# EAGLE design ReceptorTori (EAGLE 9.6.2)
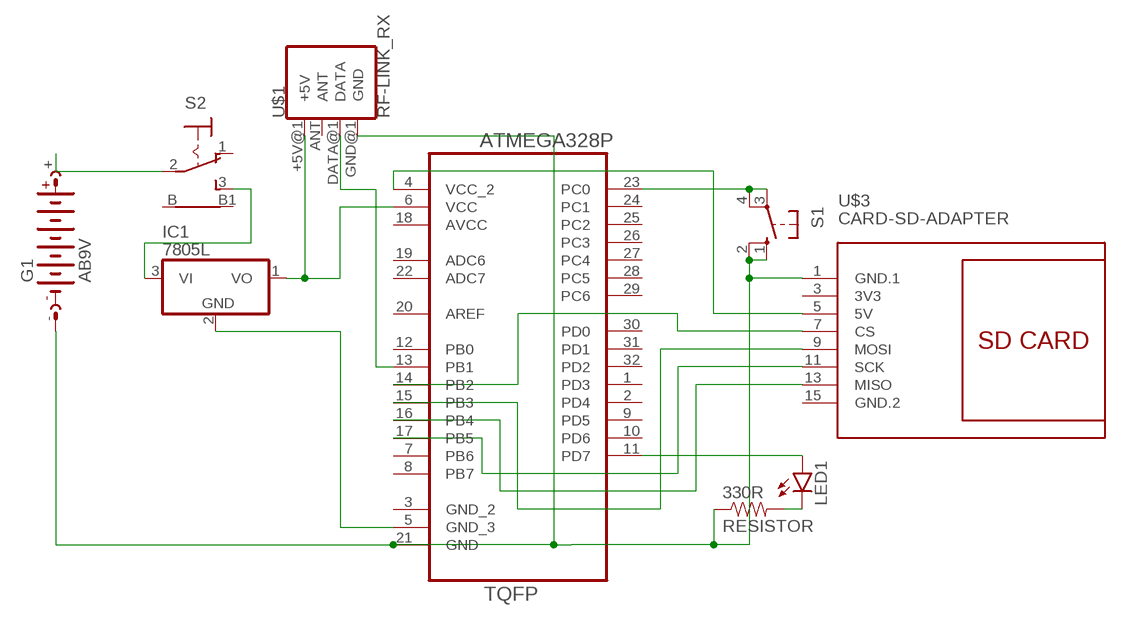
[diagram p0: schematic, sheet 1]

## Parts
330R  RESISTOR  [0603RES]
G1  AB9V  [AB9V]
IC1  7805L  [TO92]
LED1  LED5MM  [LED5MM]
S1  10-XX  [B3F-10XX]
S2  9070-1W  [9070-1W]
U1  ATMEGA328P-AU  [QFP80P900X900X120-32N]
U$1  RF-LINK_RX  [RF-LINK_RX]
U$3  CARD-SD-ADAPTER  [CARD-SD-ADAPTER]

## Nets
N$1: G1.+ S2.2(P)
N$2: IC1.1(VO) U1.6(VCC) U$1.+5V@1(+5V)
N$3: 330R.1 G1.- S1.1(S) S1.2(S1) U1.21(GND) U$1.GND@1(GND) U$3.1(GND.1)
N$4: U1.15(PB3) U$3.9(MOSI)
N$5: U1.17(PB5) U$3.11(SCK)
N$6: U1.16(PB4) U$3.13(MISO)
N$7: U1.14(PB2) U$3.7(CS)
N$8: U1.4(VCC_2) U$3.5(5V)
N$9: U1.13(PB1) U$1.DATA@1(DATA)
N$10: IC1.2(GND) U1.5(GND_3)
N$11: IC1.3(VI) S2.3(S)
N$12: 330R.2 LED1.K(C)
N$13: LED1.A U1.11(PD7)
N$14: S1.3(P) S1.4(P1) U1.23(PC0)
Unconnected: S2.1(O) S2.B S2.B1 U1.1(PD3) U1.2(PD4) U1.3(GND_2) U1.7(PB6) U1.8(PB7) U1.9(PD5) U1.10(PD6) U1.12(PB0) U1.19(ADC6) U1.20(AREF) U1.22(ADC7) U1.24(PC1) U1.25(PC2) U1.26(PC3) U1.27(PC4) U1.28(PC5) U1.29(PC6) U1.30(PD0) U1.31(PD1) U1.32(PD2) U$1.ANT

## Power pins joined to a net without a drawn wire
3V3: U$3.3(3V3)
AVCC: U1.18(AVCC)
GND.2: U$3.15(GND.2)

## Library data of the parts
330R = Ava:RESISTOR
G1 = battery:AB9V: 9-V BATTERY CLIP
IC1 = linear:78*: Positive VOLTAGE REGULATOR Source: http://cache.national.com/ds/LM/LM78L05.pdf http://www.fairchildsemi.com/ds/LM/LM7805.pdf
LED1 = led:LED: LED OSRAM: - CHIPLED LG R971, LG N971, LY N971, LG Q971, LY Q971, LO R971, LY R971 LH N974, LH R974 LS Q976, LO Q976, LY Q976 LO Q996 - Hyper CHIPLED LW Q18S LB Q993, LB Q99A, LB R99A - SideLED LS A670, LO A670, LY A670, LG A670, LP A670 LB A673, LV A673, LT A673, LW A673 LH A674 LY A675 LS A676, LA A676, LO A676, LY A676, LW A676 LS A679, LY A679, LG A679 - Hyper Micro SIDELED® LS Y876, LA Y876, LO Y876, LY Y876 LT Y87S - SmartLED LW L88C, LW L88S LB L89C, LB L89S, LG L890 LS L89K, LO L89K, LY L89K LS L896, LA L896, LO L896, LY L896 - TOPLED LS T670, LO T670, LY T670, LG T670, LP T670 LSG T670, LSP T670, LSY T670, LOP T670, LYG T670 LG T671, LOG T671, LSG T671 LB T673, LV T673, LT T673, LW T673 LH T674 LS T676, LA T676, LO T676, LY T676, LB T676, LH T676, LSB T676, LW T676 LB T67C, LV T67C, LT T67C, LS T67K, LO T67K, LY T67K, LW E67C LS E67B, LA E67B, LO E67B, LY E67B, LB E67C, LV E67C, LT E67C LW T67C LS T679, LY T679, LG T679 LS T770, LO T770, LY T770, LG T770, LP T770 LB T773, LV T773, LT T773, LW T773 LH T774 LS E675, LA E675, LY E675, LS T675 LS T776, LA T776, LO T776, LY T776, LB T776 LHGB T686 LT T68C, LB T68C - Hyper Mini TOPLED® LB M676 - Mini TOPLED Santana® LG M470 LS M47K, LO M47K, LY M47K Source: http://www.osram.convergy.de LUXEON: - LUMILED® LXK2-PW12-R00, LXK2-PW12-S00, LXK2-PW14-U00, LXK2-PW14-V00 LXK2-PM12-R00, LXK2-PM12-S00, LXK2-PM14-U00 LXK2-PE12-Q00, LXK2-PE12-R00, LXK2-PE12-S00, LXK2-PE14-T00, LXK2-PE14-U00 LXK2-PB12-K00, LXK2-PB12-L00, LXK2-PB12-M00, LXK2-PB14-N00, LXK2-PB14-P00, LXK2-PB14-Q00 LXK2-PR12-L00, LXK2-PR12-M00, LXK2-PR14-Q00, LXK2-PR14-R00 LXK2-PD12-Q00, LXK2-PD12-R00, LXK2-PD12-S00 LXK2-PH12-R00, LXK2-PH12-S00 LXK2-PL12-P00, LXK2-PL12-Q00, LXK2-PL12-R00 Source: www.luxeon.com KINGBRIGHT: KA-3528ASYC Source: www.kingbright.com
S1 = switch-omron:10-XX: OMRON SWITCH; MPN: B3F-1000; OC_FARNELL: 176432; OC_NEWARK: 36M3542
S2 = switch:9070-1W: TOGGLE SWITCH Marquardt
U1 = Ava:ATMEGA328P-AU; DESCRIPTION: 8-bit Microcontroller with In-System Programmable Flash; MPN: ATMEGA328P-AU; OC_FARNELL: 1715486; OC_NEWARK: 14R4631; PACKAGE: TQFP-32; SUPPLIER: Atmel
U$1 = SparkFun-RF:RF-LINK_RX: RF Link Receiver (434 MHz, 315 MHz) These wireless receivers work with equivalent transmitters. They can easily fit into a breadboard and work well with microcontrollers to create a very simple wireless data link. Since these are only receivers, they will only work communicating data one-way, you would need two pairs (of different frequencies) to act as a transmitter/receiver pair.. SparkFun Products RF Link Receiver - 4800bps (434 MHz) <https://www.sparkfun.com/products/10532>(WRL-10532); SF_ID: WRL-10533
U$3 = diy-modules:CARD-SD-ADAPTER: Full Size SD Card Adapter Module with onboard 3.3V regulator

## Board
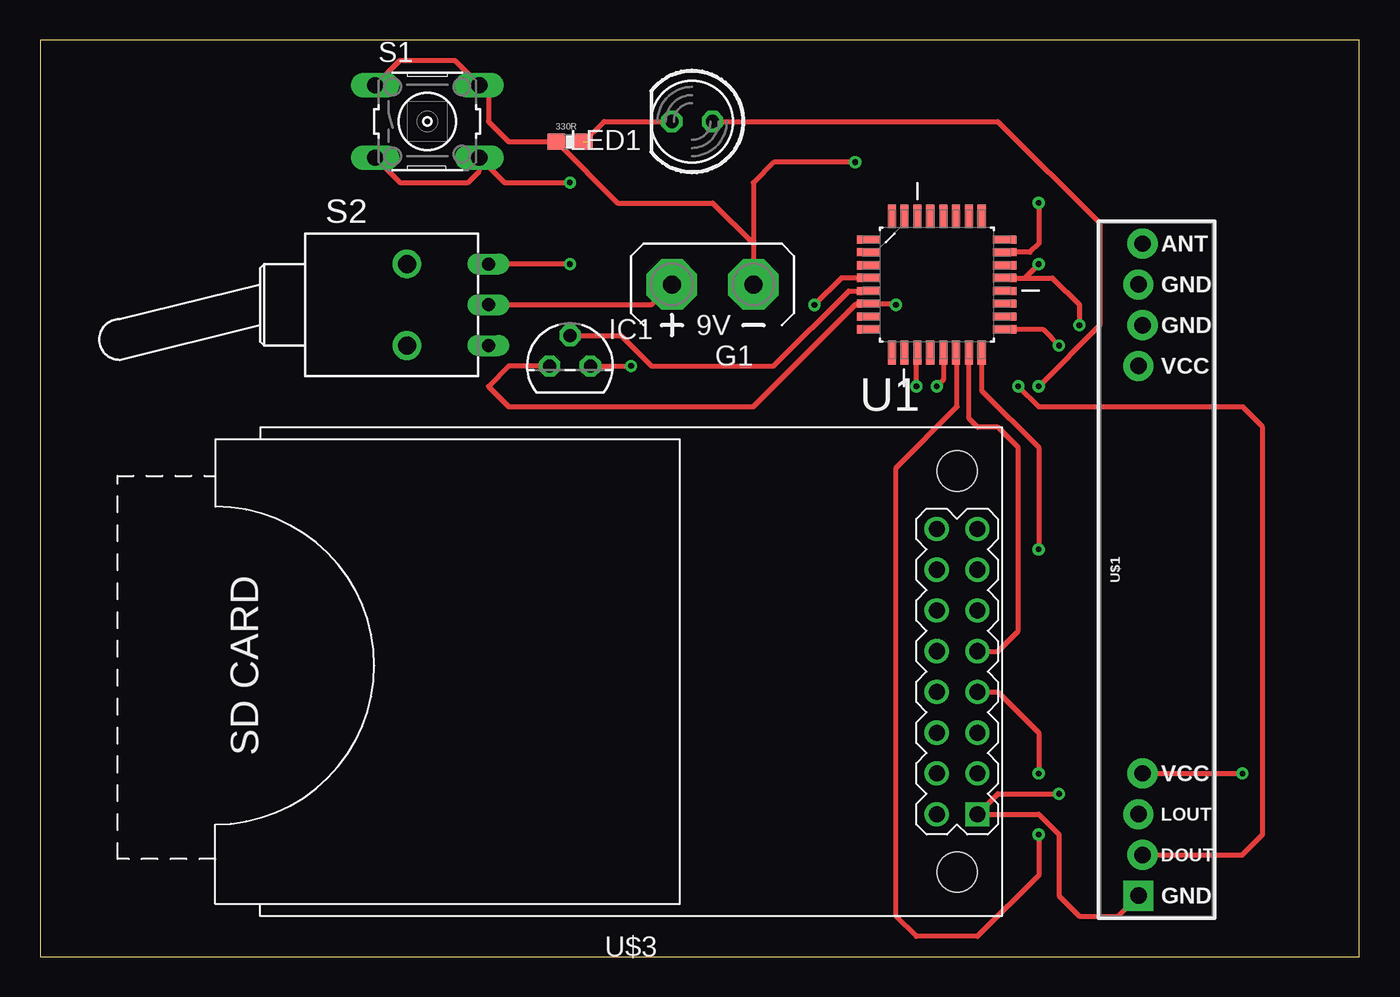
[diagram p1: board, top side]
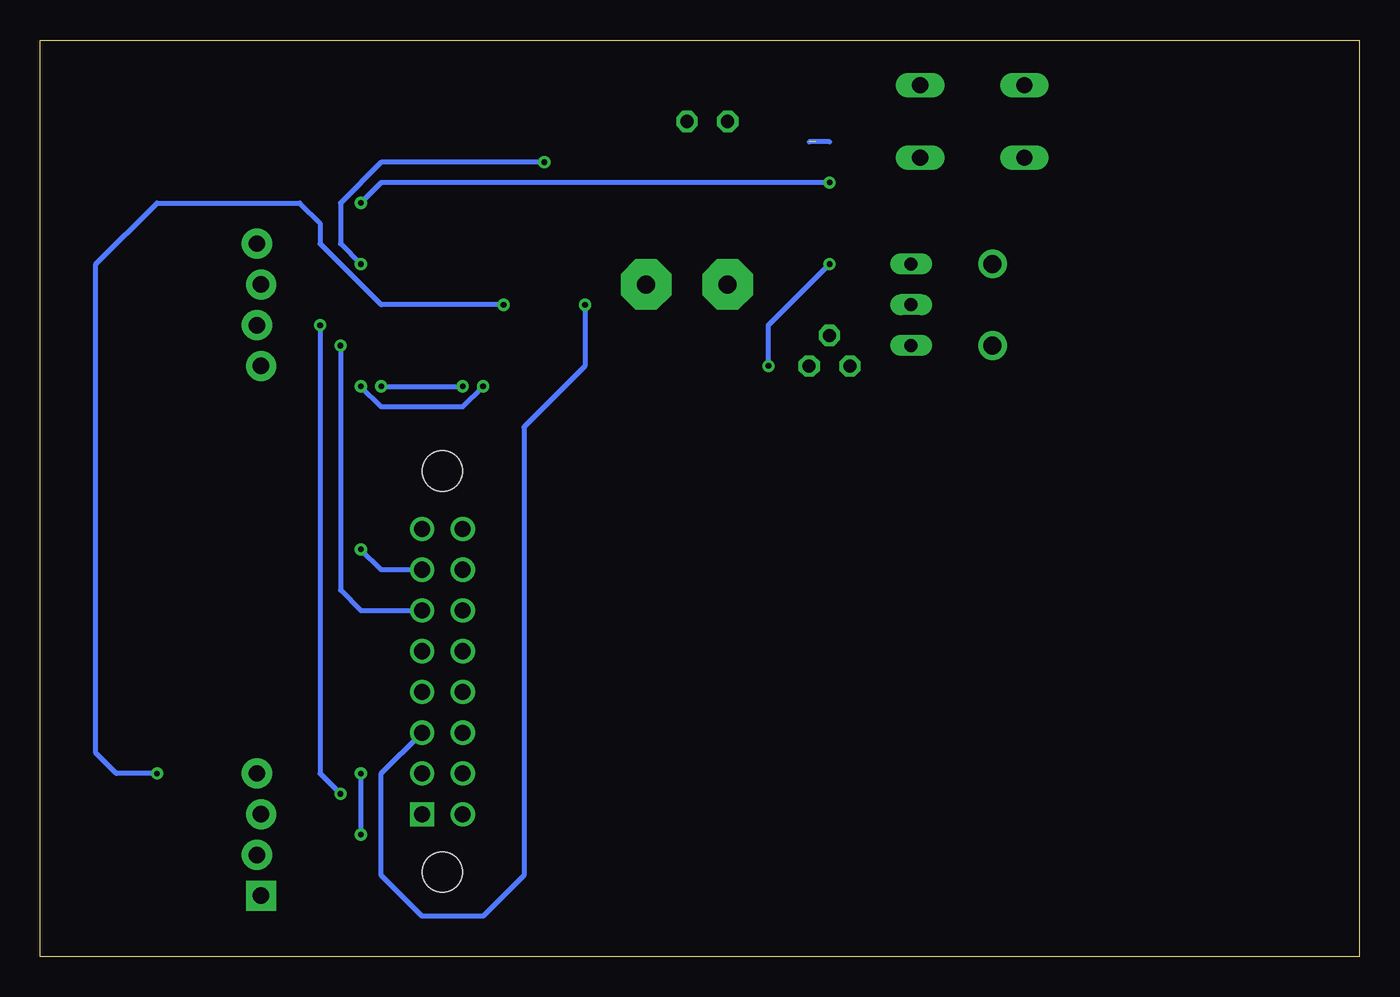
[diagram p2: board, bottom side, seen from below]

Size 82.22 x 57.14 mm. Coordinates in mm from the lower left corner, seen from the top.
Outline: 0,0 82.22,0 82.22,57.14 0,57.14 0,0
Copper layers (1*16): Top 0.035mm / dielectric 1.5mm / Bottom 0.035mm
Design rules "default": minimum track width 6mil, minimum drill 0.35mm, track to track 6mil, track to pad 6mil, pad to pad 6mil, via to via 6mil, smd to smd 6mil, copper to edge 40mil, drill to drill 6mil, minimum pad ring 10mil, minimum via ring 8mil, stop-mask expansion 4mil, vias tented up to drill 0mil, thermal gap 10mil

### Footprints (pad centres in the part's own frame; a part is rotated, then mirrored left to right if it is on the bottom)
0603RES = smd 1.1 x 1: 1 -0.85,0; 2 0.85,0
AB9V = drill 1.118 pad 3.15 octagon: + 0,2.54; - 0,-2.54
TO92 = drill 0.813 octagon: 1 -1.27,0; 2 0,1.905; 3 1.27,0
LED5MM = drill 0.813 octagon: A -1.27,0; K 1.27,0
B3F-10XX = drill 1.016 long: 1 -3.251,2.261; 2 3.251,2.261; 3 -3.251,-2.261; 4 3.251,-2.261
9070-1W = drill 0.813 long: 1 5.08,-2.54; 2 5.08,0; 3 5.08,2.54 | drill 1.118 pad 1.778: B 0,-2.54; B1 0,2.54
QFP80P900X900X120-32N = smd 1.473 x 0.508: 1 -4.242,2.794; 2 -4.242,2.007; 3 -4.242,1.194; 4 -4.242,0.406; 5 -4.242,-0.406; 6 -4.242,-1.194; 7 -4.242,-2.007; 8 -4.242,-2.794; 17 4.242,-2.794; 18 4.242,-2.007; 19 4.242,-1.194; 20 4.242,-0.406; 21 4.242,0.406; 22 4.242,1.194; 23 4.242,2.007; 24 4.242,2.794 | smd 0.508 x 1.473: 9 -2.794,-4.242; 10 -2.007,-4.242; 11 -1.194,-4.242; 12 -0.406,-4.242; 13 0.406,-4.242; 14 1.194,-4.242; 15 2.007,-4.242; 16 2.794,-4.242; 25 2.794,4.242; 26 2.007,4.242; 27 1.194,4.242; 28 0.406,4.242; 29 -0.406,4.242; 30 -1.194,4.242; 31 -2.007,4.242; 32 -2.794,4.242
RF-LINK_RX = drill 1.016 pad 1.88: +5V@1 -12.7,-0.127; +5V@2 12.7,0.127; ANT 20.32,-0.127; DATA@1 -17.78,-0.127; DATA@2 -15.24,0.127; GND@2 15.24,-0.127; GND@3 17.78,0.127 | drill 1.016 pad 1.88 square: GND@1 -20.32,0.127
CARD-SD-ADAPTER = drill 1 square: 1 -21.59,8.89 | drill 1: 2 -19.05,8.89; 3 -21.59,6.35; 4 -19.05,6.35; 5 -21.59,3.81; 6 -19.05,3.81; 7 -21.59,1.27; 8 -19.05,1.27; 9 -21.59,-1.27; 10 -19.05,-1.27; 11 -21.59,-3.81; 12 -19.05,-3.81; 13 -21.59,-6.35; 14 -19.05,-6.35; 15 -21.59,-8.89; 16 -19.05,-8.89 | hole 2.5: -20.32,12.5; -20.32,-12.5

### Placement (x,y rotation side)
330R  33.02,50.8 0 top
G1  41.91,41.91 90 top
IC1  33.02,36.83 0 top
LED1  40.64,52.07 180 top
S1  24.13,52.07 0 top
S2  22.86,40.64 0 top
U1  55.88,41.91 0 top
U$1  68.58,24.13 90 top
U$3  36.83,17.78 180 top

### Tracks (layer width: path | path; a pad name or v marks a point on that pad's centre or on a via)
N$1
  Top 0.305: G1.+ 38.1,40.64 S2.2
N$2  (via drill 0.35)
  Top 0.305: U$1.+5V@1 v74.93,11.43 | IC1.1 29.21,36.83 27.94,35.56 29.21,34.29 44.45,34.29 50.88,40.72 U1.6 53.26,40.72 v53.34,40.64
  Bottom 0.305: v74.93,11.43 77.47,11.43 78.74,12.7 78.74,43.18 74.93,46.99 66.04,46.99 64.77,45.72 64.77,44.45 60.96,40.64 v53.34,40.64
N$3  (via drill 0.35)
  Top 0.305: S1.1 22.43,55.88 25.83,55.88 S1.2 27.94,53.77 27.94,52.07 29.21,50.8 330R.1 35.98,46.99 41.91,46.99 44.45,44.45 | v62.23,43.18 61.37,42.32 U1.21 63.09,42.32 64.77,40.64 v64.77,39.37 | 44.45,44.45 G1.- | 44.45,44.45 44.45,48.26 45.72,49.53 v50.8,49.53 | U$1.GND@1 67.18,2.54 64.77,2.54 63.5,3.81 63.5,7.62 62.23,8.89 U$3.1 59.69,10.16 v63.5,10.16
  Bottom 0.305: v50.8,49.53 60.96,49.53 63.5,46.99 63.5,44.45 v62.23,43.18 | v63.5,10.16 64.77,11.43 v64.77,39.37
N$4
  Top 0.305: U$3.9 59.69,19.05 60.96,20.32 60.96,31.75 59.69,33.02 58.42,33.02 57.89,33.55 U1.15
N$5  (via drill 0.35)
  Top 0.305: U1.17 62.48,39.12 v63.5,38.1
  Bottom 0.305: v63.5,38.1 63.5,22.86 62.23,21.59 U$3.11
N$6  (via drill 0.35)
  Top 0.305: U1.16 58.67,35.31 62.23,31.75 v62.23,25.4
  Bottom 0.305: v62.23,25.4 60.96,24.13 U$3.13
N$7  (via drill 0.35)
  Top 0.305: U$3.7 59.69,16.51 62.23,13.97 v62.23,11.43 | v62.23,7.62 62.23,5.08 58.42,1.27 54.61,1.27 53.34,2.54 53.34,30.48 57.15,34.29 57.15,37.59 U1.14
  Bottom 0.305: v62.23,11.43 v62.23,7.62
N$8  (via drill 0.35)
  Top 0.305: U1.4 49.94,42.32 v48.26,40.64
  Bottom 0.305: v48.26,40.64 48.26,36.83 52.07,33.02 52.07,5.08 54.61,2.54 58.42,2.54 60.96,5.08 60.96,11.43 U$3.5
N$9  (via drill 0.35)
  Top 0.305: U$1.DATA@1 74.93,6.35 76.2,7.62 76.2,33.02 74.93,34.29 62.23,34.29 v60.96,35.56 | U1.13 56.29,35.97 v55.88,35.56
  Bottom 0.305: v60.96,35.56 v55.88,35.56
N$10
  Top 0.305: IC1.2 36.19,38.73 38.1,36.83 45.72,36.83 50.39,41.5 U1.5
N$11  (via drill 0.35)
  Top 0.305: IC1.3 v36.83,36.83 | v33.02,43.18 S2.3
  Bottom 0.305: v36.83,36.83 36.83,39.37 v33.02,43.18
N$12  (1 unrouted)
  Top 0.305: 330R.2 35.14,52.07 LED1.K
  Bottom 0.305: 33.02,50.8 34.29,50.8
N$13  (via drill 0.35)
  Top 0.305: LED1.A 59.69,52.07 66.04,45.72 66.04,39.37 v62.23,35.56 | v54.61,35.56 54.61,37.59 U1.11
  Bottom 0.305: v62.23,35.56 60.96,34.29 55.88,34.29 v54.61,35.56
N$14  (via drill 0.35)
  Top 0.305: S1.3 22.43,48.26 26.67,48.26 27.38,48.97 S1.4 28.93,48.26 v33.02,48.26 | v62.23,46.99 62.23,44.45 61.7,43.92 U1.23
  Bottom 0.305: v33.02,48.26 60.96,48.26 v62.23,46.99